# EAGLE design HomeSenseProto (EAGLE 8.6.0)
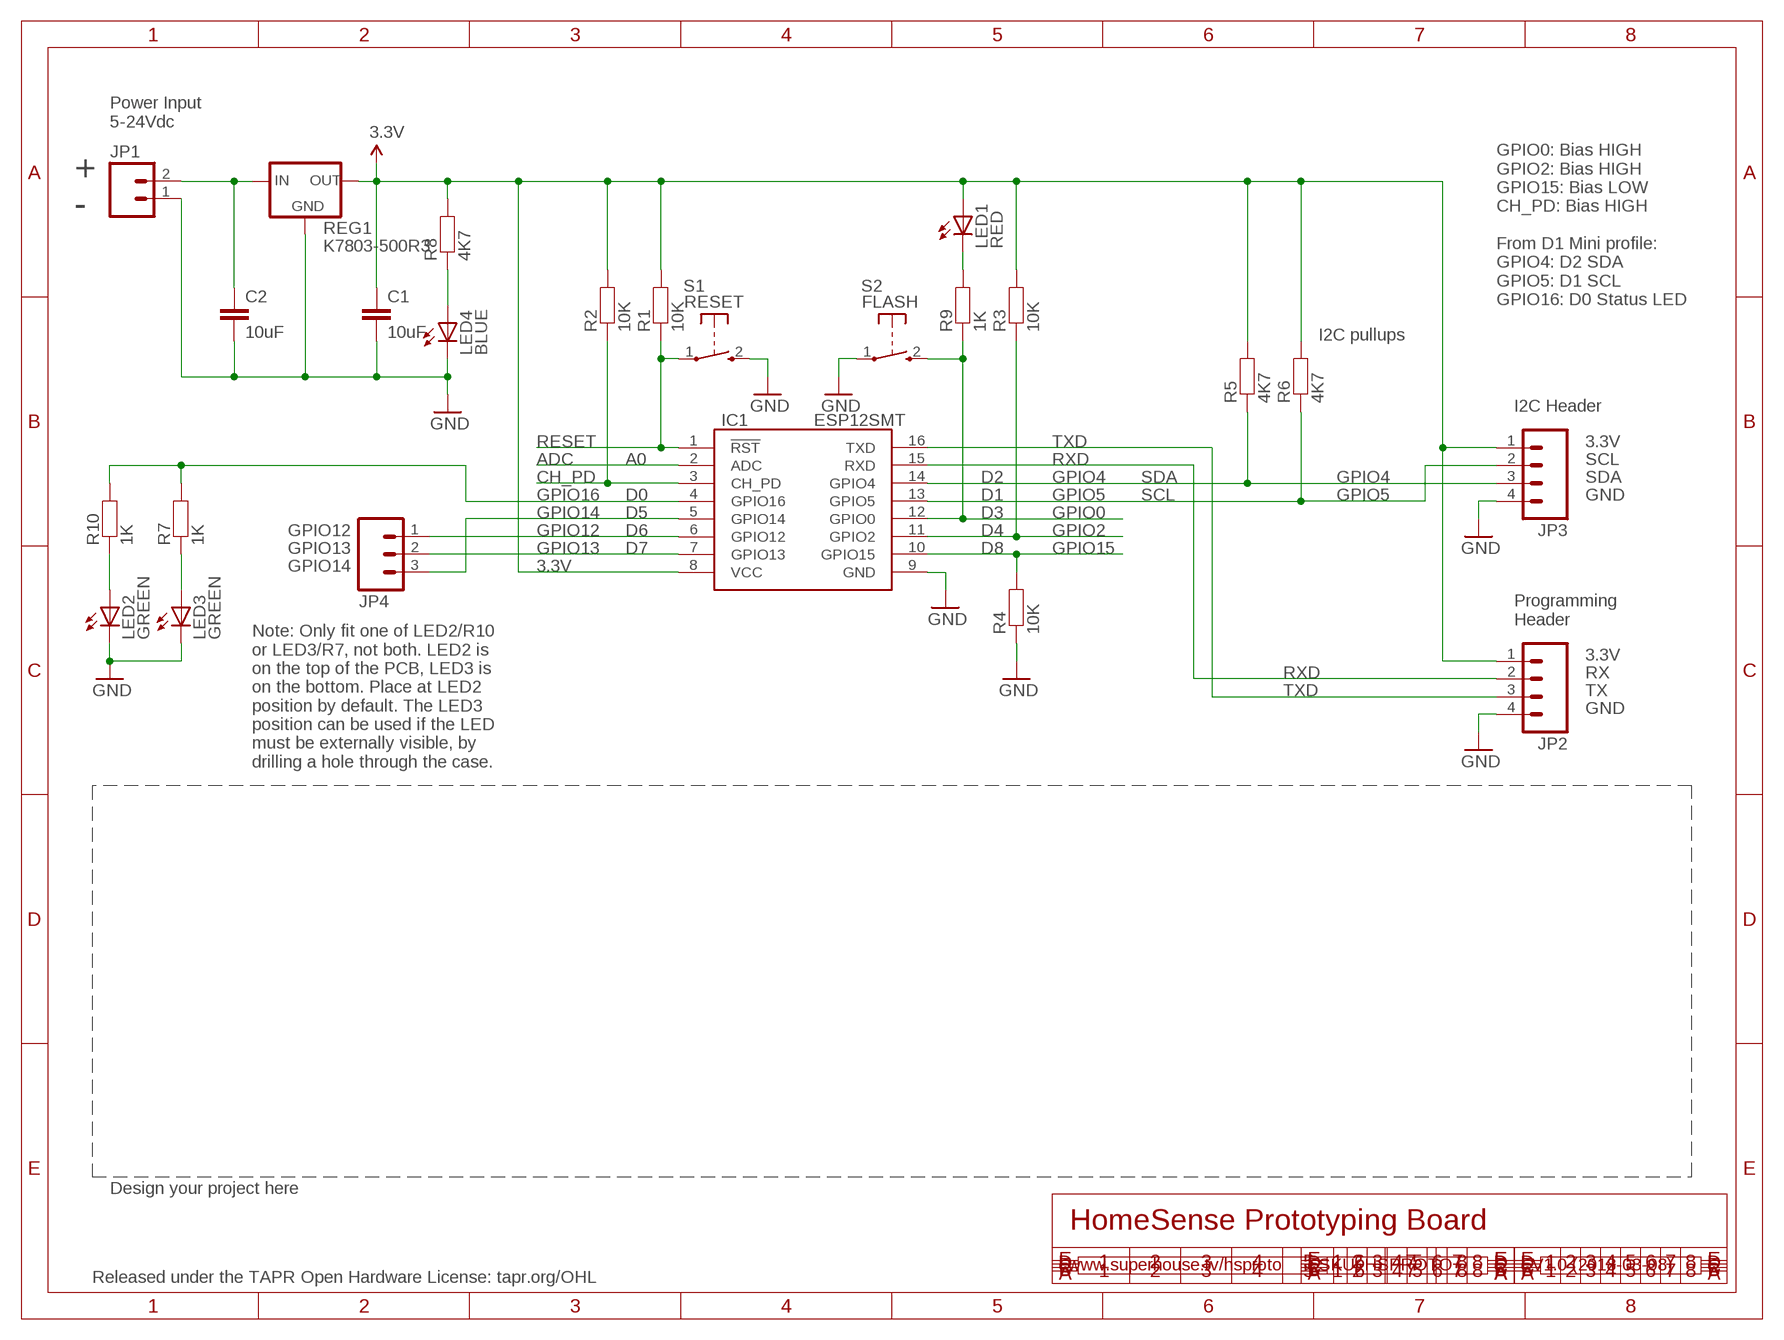
[diagram p0: schematic, sheet 1]

## Parts
C1  10uF  CAP0805  [0805]
C2  10uF  CAP0805  [0805]
IC1  ESP12SMT  [ESP12]
JP1  M02PTH  [1X02]
JP2  M04PTH  [1X04]
JP3  M04PTH  [1X04]
JP4  M03PTH  [1X03]
LED1  RED  LED0603  [LED-0603]
LED2  GREEN  LED0603  [LED-0603]
LED3  GREEN  LED0603  [LED-0603]
LED4  BLUE  LED0603  [LED-0603]
R1  10K  RESISTOR0603  [0603]
R2  10K  RESISTOR0603  [0603]
R3  10K  RESISTOR0603  [0603]
R4  10K  RESISTOR0603  [0603]
R5  4K7  RESISTOR0603  [0603]
R6  4K7  RESISTOR0603  [0603]
R7  1K  RESISTOR0603  [0603]
R8  4K7  RESISTOR0603  [0603]
R9  1K  RESISTOR0603  [0603]
R10  1K  RESISTOR0603  [0603]
REG1  K7803-500R3  K78XX-500R3  [K78XX-500R3]
S1  RESET  TAC_SWITCH_2PINSMT  [TACTILE_SWITCH_SMD_2PIN_TINY]
S2  FLASH  TAC_SWITCH_2PINSMT  [TACTILE_SWITCH_SMD_2PIN_TINY]

## Nets
3.3V: C1.1 IC1.8(VCC) JP2.1 JP3.1 LED1.A R1.2 R2.2 R3.2 R5.2 R6.2 R8.2 REG1.3(OUT)
ADC: IC1.2(ADC)
CH_PD: IC1.3(CH_PD) R2.1
GND: C1.2 C2.2 IC1.9(GND) JP1.1 JP2.4 JP3.4 LED2.C LED3.C LED4.C R4.1 REG1.2(GND) S1.2(S) S2.1(P)
GPIO0: IC1.12(GPIO0) R9.1 S2.2(S)
GPIO2: IC1.11(GPIO2) R3.1
GPIO4: IC1.14(GPIO4) JP3.3 R5.1
GPIO5: IC1.13(GPIO5) JP3.2 R6.1
GPIO12: IC1.6(GPIO12) JP4.1
GPIO13: IC1.7(GPIO13) JP4.2
GPIO14: IC1.5(GPIO14) JP4.3
GPIO15: IC1.10(GPIO15) R4.2
GPIO16: IC1.4(GPIO16) R7.2 R10.2
N$1: C2.1 JP1.2 REG1.1(IN)
N$3: LED1.C R9.2
N$11: LED3.A R7.1
N$64: LED2.A R10.1
N$65: LED4.A R8.1
RESET: IC1.1(!RST) R1.1 S1.1(P)
RXD: IC1.15(RXD) JP2.2
TXD: IC1.16(TXD) JP2.3

## Notes on the sheet
- Power Input
  5-24Vdc
- +
- -
- GPIO0: Bias HIGH
  GPIO2: Bias HIGH
  GPIO15: Bias LOW
  CH_PD: Bias HIGH
  
  From D1 Mini profile:
  GPIO4: D2 SDA
  GPIO5: D1 SCL
  GPIO16: D0 Status LED
- I2C pullups
- I2C Header
- 3.3V
- A0 | SCL
- D2 | SDA | SDA
- D0 | D1 | SCL | GND
- D5 | D3
- GPIO12 | D6 | D4
- GPIO13 | D7 | D8
- GPIO14
- Programming
  Header
- 3.3V
- RX
- TX
- GND
- Note: Only fit one of LED2/R10
  or LED3/R7, not both. LED2 is
  on the top of the PCB, LED3 is
  on the bottom. Place at LED2
  position by default. The LED3
  position can be used if the LED
  must be externally visible, by
  drilling a hole through the case.
- Design your project here
- HomeSense Prototyping Board
- www.superhouse.tv/hsproto | SKU: HSPROTO | V1.0 (2018-03-08)
- Released under the TAPR Open Hardware License: tapr.org/OHL

## Library data of the parts
C1 C2 = freetronics-jon:CAP: Capacitor Standard 0603 ceramic capacitor, and 0.1" leaded capacitor.
IC1 = freetronics-jon:ESP12
JP1 = freetronics-jon:M02: Header 2 Standard 2-pin 0.1" header. Use with straight break away headers (SKU : PRT-00116), right angle break away headers (PRT-00553), swiss pins (PRT-00743), machine pins (PRT-00117), and female headers (PRT-00115). Molex polarized connector foot print use with SKU : PRT-08233 with associated crimp pins and housings.
JP2 JP3 = freetronics-jon:M04: Header 4 Standard 4-pin 0.1" header. Use with straight break away headers (SKU : PRT-00116), right angle break away headers (PRT-00553), swiss pins (PRT-00743), machine pins (PRT-00117), and female headers (PRT-00115). Molex polarized connector foot print use with SKU : PRT-08231 with associated crimp pins and housings. 1MM SMD Version SKU: PRT-10208
JP4 = freetronics-jon:M03: Header 3 Standard 3-pin 0.1" header. Use with straight break away headers (SKU : PRT-00116), right angle break away headers (PRT-00553), swiss pins (PRT-00743), machine pins (PRT-00117), and female headers (PRT-00115). Molex polarized connector foot print use with SKU : PRT-08232 with associated crimp pins and housings.
LED1-LED4 = freetronics-jon:LED: LEDs Standard schematic elements and footprints for 5mm, 3mm, 1206, and 0603 sized LEDs. 5mm - Spark Fun Electronics SKU : COM-00529 (and others)
R1-R10 = freetronics-jon:RESISTOR: Resistor Basic schematic elements and footprints for 0603, 1206, and PTH 1/10th watt (small) resistors.
REG1 = freetronics-jon:K78XX-500R3
S1 S2 = freetronics-jon:TAC_SWITCH_2PIN: Momentary Tactile Switch - 2 pin

## Net classes
0 default: width 0.203 mm, drill 0.356 mm, clearance 0.152 mm
1 power: width 0.203 mm, clearance 0.152 mm

## Board
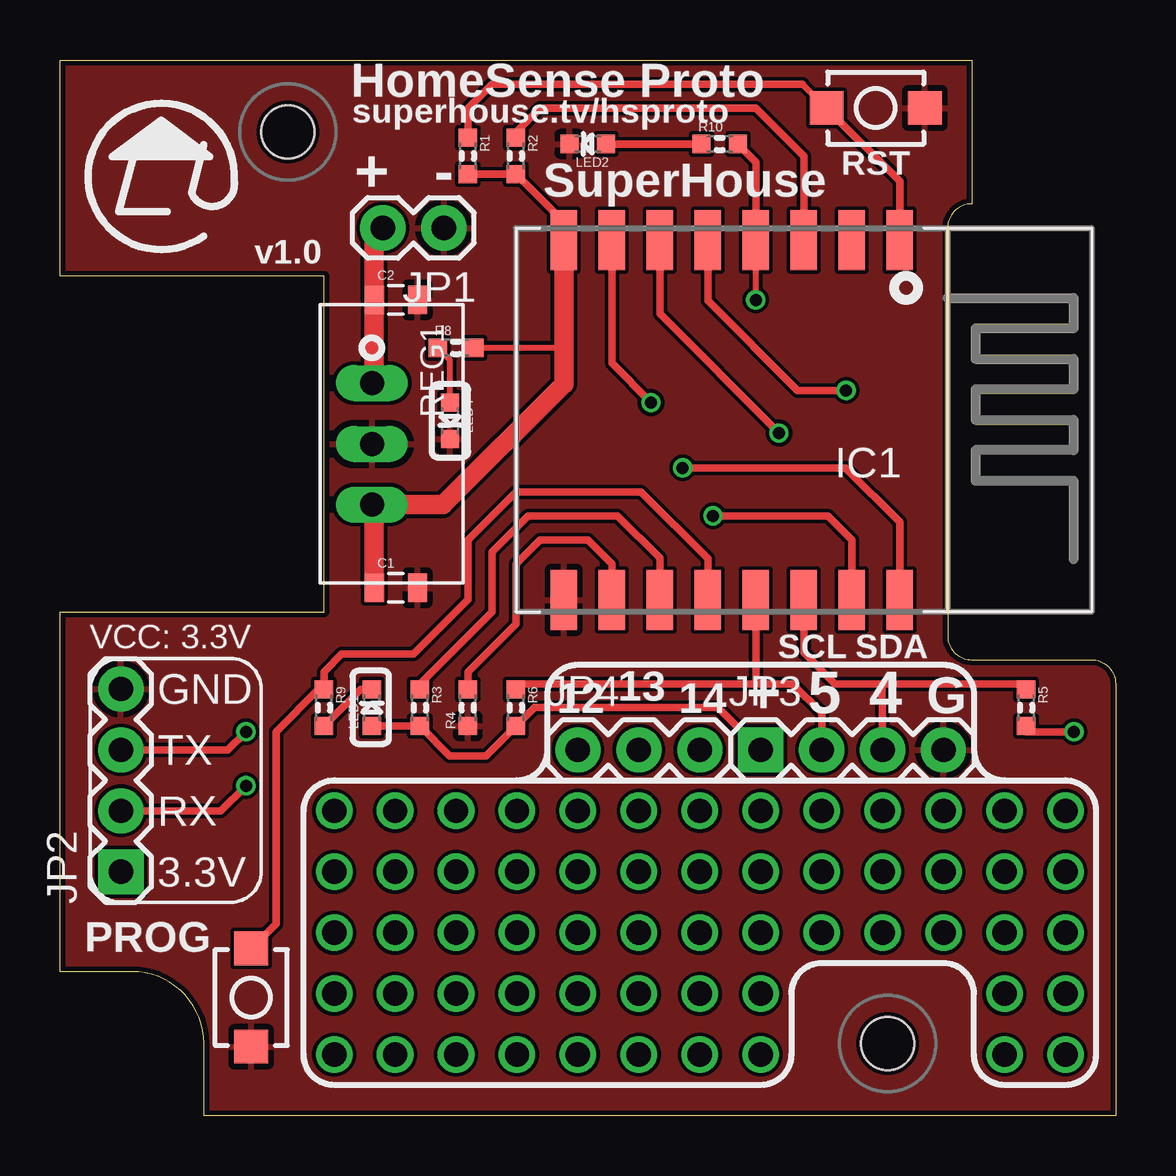
[diagram p1: board, top side]
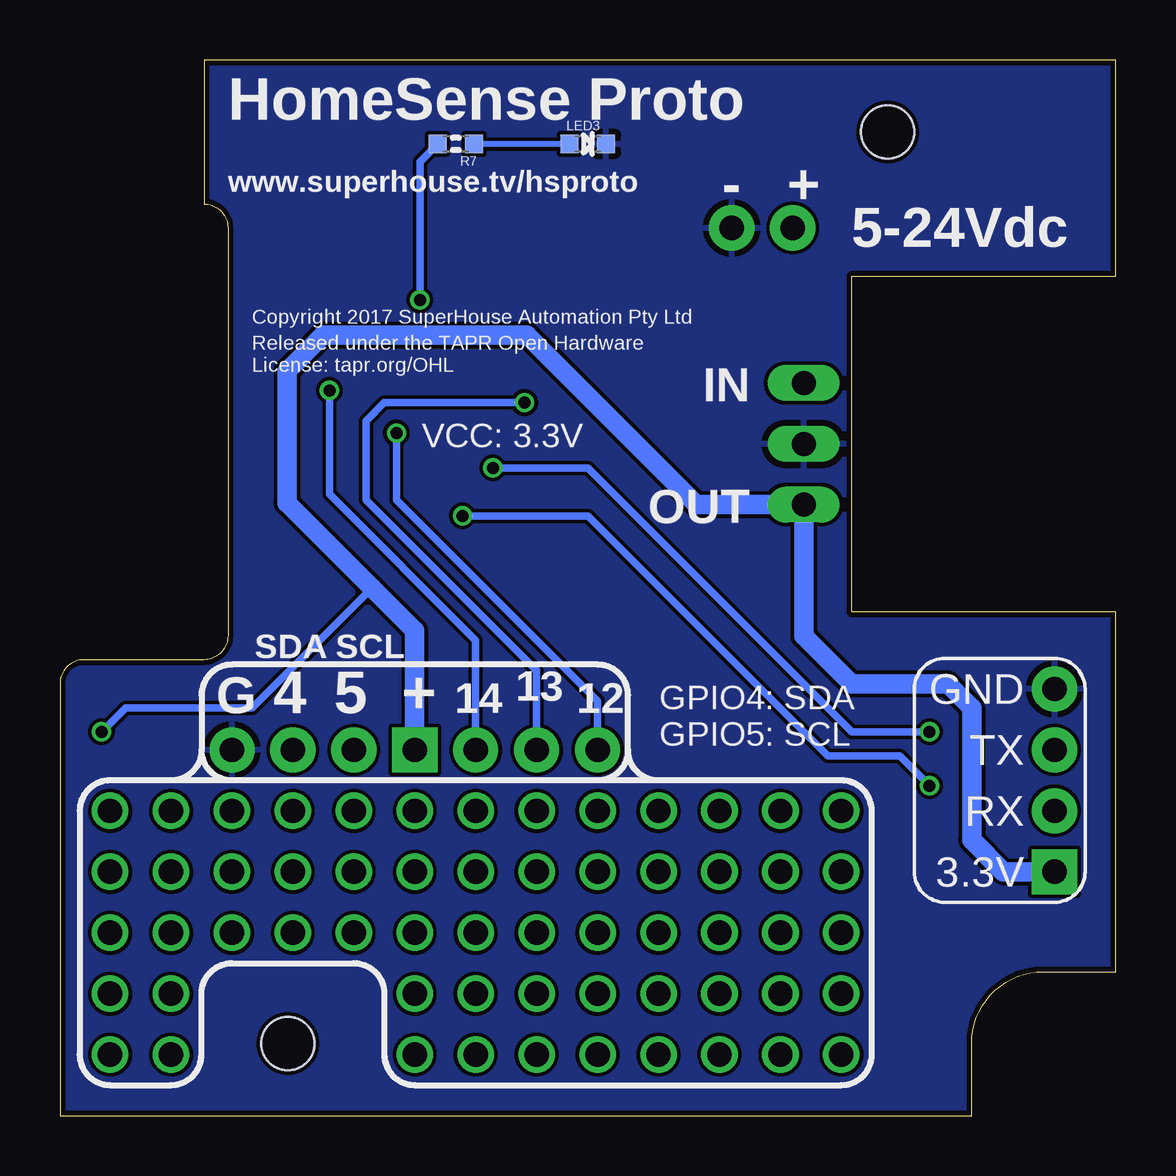
[diagram p2: board, bottom side, seen from below]

Size 44 x 44 mm. Coordinates in mm from the lower left corner, seen from the top.
Outline: 0,6 0,21 11,21 11,35 0,35 0,44 38,44 38,38 arc90 37,37 37,20 arc90 38,19 43,19 arc-90 44,18 44,0 6,0 6,3 arc90 3,6 0,6
Copper layers (1*16): Top 0.035mm / dielectric 1.5mm / Bottom 0.035mm
Design rules "ElectroDragon_2layer_DRU_no_angle_20140221": minimum track width 6mil, minimum drill 12mil, track to track 6mil, track to pad 6mil, pad to pad 6mil, via to via 6mil, smd to smd 6mil, copper to edge 8mil, drill to drill 6mil, minimum pad ring 10mil, minimum via ring 6mil, stop-mask expansion 4mil, vias tented up to drill 100mil, thermal gap 10mil
Holes 2.2 mm at 34.5,3 9.5,41

### Footprints (pad centres in the part's own frame; a part is rotated, then mirrored left to right if it is on the bottom)
0805 = smd 0.8 x 1.2: 1 -0.9,0; 2 0.9,0
ESP12 = smd 1.1 x 2.5: 1 -4,-7.5; 2 -2,-7.5; 3 0,-7.5; 4 2,-7.5; 5 4,-7.5; 6 6,-7.5; 7 8,-7.5; 8 10,-7.5; 9 10,7.5; 10 8,7.5; 11 6,7.5; 12 4,7.5; 13 2,7.5; 14 0,7.5; 15 -2,7.5; 16 -4,7.5
1X02 = drill 1.016 pad 1.88: 1 0,0; 2 2.54,0
1X04 = drill 1.016 pad 1.88 square: 1 0,0 | drill 1.016 pad 1.88: 2 2.54,0; 3 5.08,0; 4 7.62,0
1X03 = drill 1.016 pad 1.88: 1 0,0; 2 2.54,0; 3 5.08,0
LED-0603 = smd 0.762 x 0.762: A -0.762,0; C 0.762,0
0603 = smd 0.762 x 0.762: 1 -0.762,0; 2 0.762,0
K78XX-500R3 = drill 1 long: 1 -2.54,0; 2 0,0; 3 2.54,0
TACTILE_SWITCH_SMD_2PIN_TINY = smd 1.4 x 1.4: 1 -2.05,0; 2 2.05,0

### Placement (x,y rotation side)
C1  14,22 0 top
C2  14,34 0 top
IC1  31,29 180 top
JP1  16,37 180 top
JP2  2.54,10.16 90 top
JP3  29.21,15.24 0 top
JP4  21.59,15.24 0 top
LED1  13,17 90 top
LED2  22,40.5 180 top
LED3  22,40.5 0 bottom
LED4  16.26,28.96 270 top
R1  17,40 270 top
R2  19,40 270 top
R3  15,17 270 top
R4  17,17 90 top
R5  40.27,17 270 top
R6  19,17 270 top
R7  27.5,40.5 180 bottom
R8  16.51,32 0 top
R9  11,17 270 top
R10  27.5,40.5 0 top
REG1  13,28 270 top
S1  34,42 0 top
S2  7.97,4.92 90 top

### Tracks (layer width: path | path; a pad name or v marks a point on that pad's centre or on a via)
3.3V  (via drill 0.5)
  Top 0.254: 21,37.24 IC1.8 | R5.2 40.27,16 | R8.2 21,32
  Top 0.305: LED1.A R3.2 16.24,15 17.76,15 R6.2 19.78,17.02 27.43,17.02 JP3.1 | R1.2 R2.2 21,37.24 | 40.27,16 v42.27,16
  Top 0.813: IC1.8 21,32 21,30.49 15.97,25.46 REG1.3 13.1,25.36 C1.1
  Bottom 0.305: v42.27,16 41.27,17 36,17 31,22
  Bottom 0.813: JP2.1 4.67,10.16 6,11.49 6,17 7,18 11,18 13,20 REG1.3 17.46,25.46 24.54,32.54 33.03,32.54 34.54,31.03 34.54,25.54 31,22 29.21,20.21 JP3.1
CH_PD
  Top 0.254: 19,41 R2.1
  Top 0.305: IC1.3 31,40 29,42 20,42 19,41
GND
  pour Top: 0,6 3,6 arc-90 6,3 6,0 44,0 44,18 arc90 43,19 38,19 arc-90 37,20 37,37 arc-90 38,38 38,44 0,44 0,35 11,35 11,21 0,21
  pour Bottom: 38,44 0,44 0,35 11,35 11,21 0,21 0,6 3,6 arc-90 6,3 6,0 44,0 44,18 arc90 43,19 38,19 arc-90 37,20 37,37 arc-90 38,38
GPIO0
  Top 0.254: 10.76,17.76 R9.1
  Top 0.305: IC1.12 27,23.22 24.22,26 19.02,26 17,23.98 17,21.51 14.73,19.24 11.75,19.24 11,18.49 R9.1 | S2.2 9,8 9,16 10.76,17.76
GPIO2
  Top 0.254: 15,18 R3.1
  Top 0.305: 15,18 18,21 18,23.49 19.51,25 23.24,25 25,23.24 IC1.11
GPIO4
  Top 0.305: R5.1 40.27,18 34.27,18 | 34.27,18 34.29,16.75 JP3.3 | IC1.14 31,20 31,19.29 32.29,18 34.27,18
GPIO5
  Top 0.254: R6.1 19.24,18 | 29,18.04 28.96,18
  Top 0.305: 19.24,18 28.96,18 30.54,18 31.75,16.79 JP3.2 | IC1.13 29,18.04
GPIO12  (via drill 0.5)
  Top 0.305: v29.97,28.45 25,33.42 IC1.6
  Bottom 0.305: JP4.1 21.59,17.27 29.97,25.65 v29.97,28.45
GPIO13  (via drill 0.5)
  Top 0.305: v24.64,29.72 23,31.36 IC1.7
  Bottom 0.305: JP4.2 24.13,18.54 31.24,25.65 31.24,28.96 30.48,29.72 v24.64,29.72
GPIO14  (via drill 0.5)
  Top 0.305: v32.77,30.23 30.73,30.23 27,33.96 IC1.5
  Bottom 0.305: JP4.3 26.67,19.81 32.77,25.91 v32.77,30.23
GPIO15
  Top 0.305: IC1.10 23,23 22,24 20,24 19,23 19,20.49 17,18.49 R4.2
GPIO16  (via drill 0.5)
  Top 0.254: v29,34 IC1.4
  Top 0.305: R7.2 29,39.74 IC1.4
  Bottom 0.305: R7.2 29,39.76 v29,34
N$1
  Top 0.813: JP1.2 13.1,36.64 C2.1 13.1,30.64 REG1.1
N$2  (via drill 1.02)
  other vias: 19.05,5.08
N$3
  Top 0.305: R9.2 12.52,17.76 LED1.C
N$4  (via drill 1.02)
  other vias: 21.59,2.54
N$5  (via drill 1.02)
  other vias: 24.13,2.54
N$6  (via drill 1.02)
  other vias: 26.67,2.54
N$7  (via drill 1.02)
  other vias: 29.21,2.54
N$8  (via drill 1.02)
  other vias: 29.21,5.08
N$9  (via drill 1.02)
  other vias: 26.67,5.08
N$10  (via drill 1.02)
  other vias: 24.13,5.08
N$11
  Bottom 0.254: LED3.A R7.1
N$12  (via drill 1.02)
  other vias: 21.59,5.08
N$13  (via drill 1.02)
  other vias: 21.59,7.62
N$14  (via drill 1.02)
  other vias: 24.13,7.62
N$15  (via drill 1.02)
  other vias: 26.67,7.62
N$16  (via drill 1.02)
  other vias: 29.21,7.62
N$17  (via drill 1.02)
  other vias: 29.21,10.16
N$18  (via drill 1.02)
  other vias: 26.67,10.16
N$19  (via drill 1.02)
  other vias: 24.13,10.16
N$20  (via drill 1.02)
  other vias: 21.59,10.16
N$21  (via drill 1.02)
  other vias: 19.05,10.16
N$22  (via drill 1.02)
  other vias: 19.05,7.62
N$23  (via drill 1.02)
  other vias: 16.51,10.16
N$24  (via drill 1.02)
  other vias: 16.51,7.62
N$26  (via drill 1.02)
  other vias: 16.51,5.08
N$27  (via drill 1.02)
  other vias: 31.75,10.16
N$28  (via drill 1.02)
  other vias: 34.29,10.16
N$29  (via drill 1.02)
  other vias: 36.83,10.16
N$30  (via drill 1.02)
  other vias: 39.37,10.16
N$31  (via drill 1.02)
  other vias: 41.91,10.16
N$32  (via drill 1.02)
  other vias: 41.91,12.7
N$33  (via drill 1.02)
  other vias: 39.37,12.7
N$34  (via drill 1.02)
  other vias: 36.83,12.7
N$35  (via drill 1.02)
  other vias: 34.29,12.7
N$36  (via drill 1.02)
  other vias: 31.75,12.7
N$37  (via drill 1.02)
  other vias: 29.21,12.7
N$38  (via drill 1.02)
  other vias: 26.67,12.7
N$39  (via drill 1.02)
  other vias: 13.97,5.08
N$40  (via drill 1.02)
  other vias: 13.97,2.54
N$41  (via drill 1.02)
  other vias: 16.51,2.54
N$42  (via drill 1.02)
  other vias: 19.05,2.54
N$43  (via drill 1.02)
  other vias: 31.75,7.62
N$44  (via drill 1.02)
  other vias: 34.29,7.62
N$45  (via drill 1.02)
  other vias: 36.83,7.62
N$46  (via drill 1.02)
  other vias: 39.37,7.62
N$47  (via drill 1.02)
  other vias: 41.91,7.62
N$48  (via drill 1.02)
  other vias: 41.91,5.08
N$49  (via drill 1.02)
  other vias: 41.91,2.54
N$50  (via drill 1.02)
  other vias: 39.37,2.54
N$51  (via drill 1.02)
  other vias: 39.37,5.08
N$52  (via drill 1.02)
  other vias: 13.97,10.16
N$53  (via drill 1.02)
  other vias: 13.97,7.62
N$54  (via drill 1.02)
  other vias: 24.13,12.7
N$55  (via drill 1.02)
  other vias: 21.59,12.7
N$56  (via drill 1.02)
  other vias: 19.05,12.7
N$57  (via drill 1.02)
  other vias: 16.51,12.7
N$58  (via drill 1.02)
  other vias: 13.97,12.7
N$59  (via drill 1.02)
  other vias: 11.43,5.08
N$60  (via drill 1.02)
  other vias: 11.43,2.54
N$61  (via drill 1.02)
  other vias: 11.43,10.16
N$62  (via drill 1.02)
  other vias: 11.43,7.62
N$63  (via drill 1.02)
  other vias: 11.43,12.7
N$64
  Top 0.305: LED2.A R10.1
N$65
  Top 0.254: LED4.A 16.26,31.5 R8.1
RESET
  Top 0.254: S1.1 30.95,43
  Top 0.305: IC1.1 35,38.95 S1.1 | R1.1 17,42 18,43 30.95,43
RXD  (via drill 0.5)
  Top 0.305: JP2.2 6.71,12.7 v7.75,13.75 | v27.22,25 32,25 33,24 IC1.15
  Bottom 0.254: v7.75,13.75 8,14
  Bottom 0.305: 8,14 9,15 12,15 22,25 v27.22,25
TXD  (via drill 0.5)
  Top 0.305: JP2.3 6.99,15.24 v7.75,16 | v25.95,27 32.73,27 35,24.73 IC1.16
  Bottom 0.305: v7.75,16 11,16 22,27 v25.95,27

### Text on the board
tPlace: HomeSense Proto | superhouse.tv/hsproto | RST | + | - | SuperHouse | v1.0 | VCC: 3.3V | SCL | SDA | GND | 12 | 13 | 14 | + | 5 | 4 | G | TX | RX | 3.3V | PROG
bPlace: HomeSense Proto | + | - | www.superhouse.tv/hsproto | 5-24Vdc | Copyright 2017 SuperHouse Automation Pty Ltd | Released under the TAPR Open Hardware / License: tapr.org/OHL | IN | VCC: 3.3V | OUT | SCL | SDA | GND | 12 | 13 | 14 | + | 5 | 4 | G | TX | GPIO4: SDA / GPIO5: SCL | RX | 3.3V